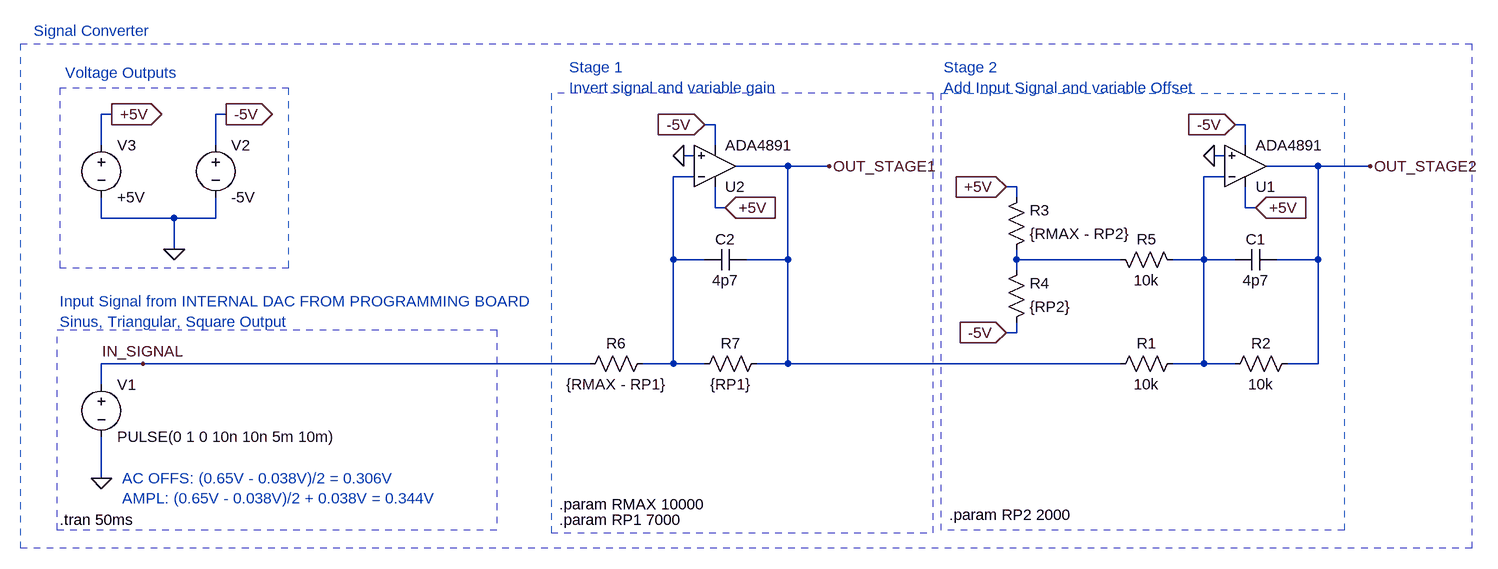
[diagram p0: schematic signal_converter.asc]
signal_converter.asc, the LTspice schematic file:
Version 4
SHEET 1 2624 1108
WIRE 32 -320 16 -320
WIRE 208 -320 192 -320
WIRE 960 -304 944 -304
WIRE 1776 -304 1760 -304
WIRE 16 -272 16 -320
WIRE 192 -272 192 -320
WIRE 960 -272 960 -304
WIRE 1776 -272 1776 -304
WIRE 928 -256 912 -256
WIRE 1744 -256 1728 -256
WIRE 1072 -240 992 -240
WIRE 1136 -240 1072 -240
WIRE 1888 -240 1808 -240
WIRE 1968 -240 1888 -240
WIRE 928 -224 896 -224
WIRE 1744 -224 1712 -224
WIRE 1424 -208 1408 -208
WIRE 1424 -192 1424 -208
WIRE 960 -176 960 -208
WIRE 976 -176 960 -176
WIRE 1776 -176 1776 -208
WIRE 1792 -176 1776 -176
WIRE 16 -160 16 -192
WIRE 128 -160 16 -160
WIRE 192 -160 192 -192
WIRE 192 -160 128 -160
WIRE 128 -112 128 -160
WIRE 896 -96 896 -224
WIRE 944 -96 896 -96
WIRE 1072 -96 1072 -240
WIRE 1072 -96 1008 -96
WIRE 1424 -96 1424 -112
WIRE 1584 -96 1424 -96
WIRE 1712 -96 1712 -224
WIRE 1712 -96 1664 -96
WIRE 1760 -96 1712 -96
WIRE 1888 -96 1888 -240
WIRE 1888 -96 1824 -96
WIRE 1424 -80 1424 -96
WIRE 1424 16 1424 0
WIRE 1424 16 1408 16
WIRE 80 64 16 64
WIRE 768 64 80 64
WIRE 896 64 896 -96
WIRE 896 64 848 64
WIRE 944 64 896 64
WIRE 1072 64 1072 -96
WIRE 1072 64 1024 64
WIRE 1584 64 1072 64
WIRE 1712 64 1712 -96
WIRE 1712 64 1664 64
WIRE 1760 64 1712 64
WIRE 1888 64 1888 -96
WIRE 1888 64 1840 64
WIRE 16 96 16 64
WIRE 16 240 16 176
FLAG 16 240 0
FLAG 128 -112 0
FLAG 32 -320 +5V
IOPIN 32 -320 Out
FLAG 208 -320 -5V
IOPIN 208 -320 Out
FLAG 80 64 IN_SIGNAL
FLAG 1792 -176 +5V
IOPIN 1792 -176 In
FLAG 1760 -304 -5V
IOPIN 1760 -304 In
FLAG 1968 -240 OUT_STAGE2
FLAG 1408 -208 +5V
IOPIN 1408 -208 In
FLAG 976 -176 +5V
IOPIN 976 -176 In
FLAG 944 -304 -5V
IOPIN 944 -304 In
FLAG 1408 16 -5V
IOPIN 1408 16 In
FLAG 1136 -240 OUT_STAGE1
FLAG 1728 -256 0
FLAG 912 -256 0
SYMBOL voltage 16 80 R0
WINDOW 123 0 0 Left 2
WINDOW 39 0 0 Left 2
SYMATTR InstName V1
SYMATTR Value PULSE(0 1 0 10n 10n 5m 10m)
SYMBOL voltage 192 -288 R0
WINDOW 123 0 0 Left 2
WINDOW 39 0 0 Left 2
SYMATTR InstName V2
SYMATTR Value -5V
SYMBOL voltage 16 -288 R0
WINDOW 123 0 0 Left 2
WINDOW 39 0 0 Left 2
SYMATTR InstName V3
SYMATTR Value +5V
SYMBOL res 928 80 R270
WINDOW 3 0 56 VBottom 2
WINDOW 0 32 56 VTop 2
SYMATTR Value {RP1}
SYMATTR InstName R7
SYMBOL ADA4891 1776 -176 M180
SYMATTR InstName U1
SYMBOL /res 864 48 R90
WINDOW 0 0 56 VBottom 2
WINDOW 3 32 56 VTop 2
SYMATTR InstName R6
SYMATTR Value {RMAX - RP1}
SYMBOL res 1408 -96 M180
WINDOW 0 36 76 Left 2
WINDOW 3 36 40 Left 2
SYMATTR InstName R3
SYMATTR Value {RMAX - RP2}
SYMBOL res 1408 16 M180
WINDOW 0 36 76 Left 2
WINDOW 3 36 40 Left 2
SYMATTR InstName R4
SYMATTR Value {RP2}
SYMBOL ADA4891 960 -176 M180
SYMATTR InstName U2
SYMBOL res 1680 48 R90
WINDOW 0 0 56 VBottom 2
WINDOW 3 32 56 VTop 2
SYMATTR InstName R1
SYMATTR Value 10k
SYMBOL res 1680 -80 M270
WINDOW 0 32 56 VTop 2
WINDOW 3 0 56 VBottom 2
SYMATTR InstName R5
SYMATTR Value 10k
SYMBOL res 1856 48 R90
WINDOW 0 0 56 VBottom 2
WINDOW 3 32 56 VTop 2
SYMATTR InstName R2
SYMATTR Value 10k
SYMBOL cap 1008 -112 R90
WINDOW 0 0 32 VBottom 2
WINDOW 3 32 32 VTop 2
SYMATTR InstName C2
SYMATTR Value 4p7
SYMBOL cap 1824 -112 R90
WINDOW 0 0 32 VBottom 2
WINDOW 3 32 32 VTop 2
SYMATTR InstName C1
SYMATTR Value 4p7
TEXT -48 304 Left 2 !.tran 50ms
TEXT 48 240 Left 2 ;AC OFFS: (0.65V - 0.038V)/2 = 0.306V\nAMPL: (0.65V - 0.038V)/2 + 0.038V = 0.344V
TEXT -40 -384 Left 2 ;Voltage Outputs
TEXT -48 -32 Left 2 ;Input Signal from INTERNAL DAC FROM PROGRAMMING BOARD\nSinus, Triangular, Square Output
TEXT 1312 -392 Left 2 ;Stage 2\nAdd Input Signal and variable Offset
TEXT 720 304 Left 2 !.param RP1 7000
TEXT 1320 296 Left 2 !.param RP2 2000
TEXT -88 -448 Left 2 ;Signal Converter
TEXT 720 280 Left 2 !.param RMAX 10000
TEXT 736 -392 Left 2 ;Stage 1\nInvert signal and variable gain
RECTANGLE Normal 304 -360 -48 -84 1
RECTANGLE Normal -52 12 624 320 1
RECTANGLE Normal 1308 -352 1928 320 1
RECTANGLE Normal -108 -428 2124 348 1
RECTANGLE Normal 1296 -352 708 324 1

The netlist it stands for:
* signal_converter.asc
V1 IN_SIGNAL 0 PULSE(0 1 0 10n 10n 5m 10m)
V2 -5V 0 -5V
V3 +5V 0 +5V
R7 N001 OUT_STAGE1 {RP1}
XU1 0 N002 +5V -5V OUT_STAGE2 ADA4891-1  ; pins In+ In- V+ V- OUT
R6 N001 IN_SIGNAL {RMAX - RP1}
R3 N003 +5V {RMAX - RP2}
R4 -5V N003 {RP2}
XU2 0 N001 +5V -5V OUT_STAGE1 ADA4891-1  ; pins In+ In- V+ V- OUT
R1 N002 OUT_STAGE1 10k
R5 N002 N003 10k
R2 OUT_STAGE2 N002 10k
C2 OUT_STAGE1 N001 4p7
C1 OUT_STAGE2 N002 4p7
.tran 50ms
* AC OFFS: (0.65V - 0.038V)/2 = 0.306V
* AMPL: (0.65V - 0.038V)/2 + 0.038V = 0.344V
* Voltage Outputs
* Input Signal from INTERNAL DAC FROM PROGRAMMING BOARD
* Sinus, Triangular, Square Output
* Stage 2
* Add Input Signal and variable Offset
.param RP1 7000
.param RP2 2000
* Signal Converter
.param RMAX 10000
* Stage 1
* Invert signal and variable gain
.lib ADA4891-1.lib
.backanno
.end